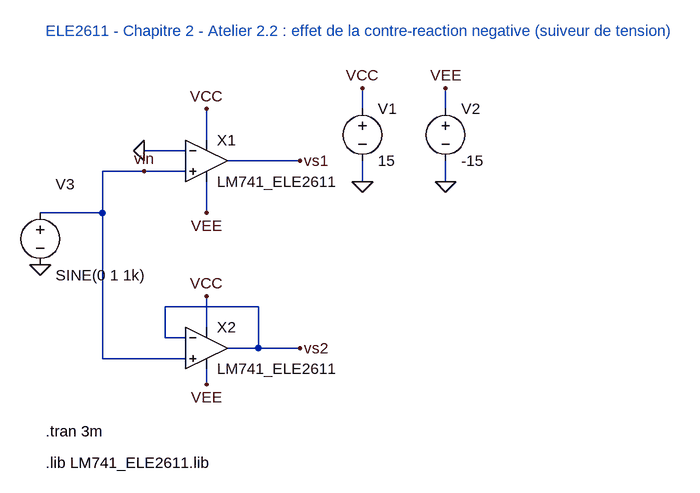
[diagram p0: schematic Ch2_Atelier_2_2_Suiveur.asc]
Ch2_Atelier_2_2_Suiveur.asc, the LTspice schematic file:
Version 4
SHEET 1 1200 1000
WIRE 64 320 160 320
WIRE 160 256 160 544
WIRE 160 256 224 256
WIRE 224 256 288 256
WIRE 160 544 288 544
WIRE 288 224 224 224
WIRE 320 160 320 208
WIRE 320 272 320 320
WIRE 352 240 464 240
WIRE 320 448 320 496
WIRE 320 560 320 584
WIRE 352 528 400 528
WIRE 400 464 400 528
WIRE 256 464 400 464
WIRE 256 464 256 512
WIRE 256 512 288 512
WIRE 400 528 464 528
WIRE 560 128 560 160
WIRE 560 240 560 272
WIRE 688 128 688 160
WIRE 688 240 688 272
FLAG 64 400 0
FLAG 224 256 vin
FLAG 224 224 0
FLAG 320 160 VCC
FLAG 320 320 VEE
FLAG 464 240 vs1
FLAG 320 448 VCC
FLAG 320 584 VEE
FLAG 464 528 vs2
FLAG 560 128 VCC
FLAG 560 272 0
FLAG 688 128 VEE
FLAG 688 272 0
SYMBOL voltage 64 304 R0
WINDOW 0 24 -28 Left 2
WINDOW 3 24 112 Left 2
SYMATTR InstName V3
SYMATTR Value SINE(0 1 1k)
SYMBOL Opamps\\opamp2 320 176 R0
SYMATTR InstName X1
SYMATTR Value LM741_ELE2611
SYMBOL Opamps\\opamp2 320 464 R0
SYMATTR InstName X2
SYMATTR Value LM741_ELE2611
SYMBOL voltage 560 144 R0
SYMATTR InstName V1
SYMATTR Value 15
SYMBOL voltage 688 144 R0
SYMATTR InstName V2
SYMATTR Value -15
TEXT 72 40 Left 2 ;ELE2611 - Chapitre 2 - Atelier 2.2 : effet de la contre-reaction negative (suiveur de tension)
TEXT 72 656 Left 2 !.tran 3m
TEXT 72 704 Left 2 !.lib LM741_ELE2611.lib

The netlist it stands for:
* Ch2_Atelier_2_2_Suiveur.asc
V3 vin 0 SINE(0 1 1k)
XX1 vin 0 VCC VEE vs1 LM741_ELE2611  ; pins In+ In- V+ V- OUT
XX2 vin vs2 VCC VEE vs2 LM741_ELE2611  ; pins In+ In- V+ V- OUT
V1 VCC 0 15
V2 VEE 0 -15
* ELE2611 - Chapitre 2 - Atelier 2.2 : effet de la contre-reaction negative (suiveur de tension)
.tran 3m
.lib LM741_ELE2611.lib
.backanno
.end